# EAGLE schematic ControlBoard (EAGLE 9.2.2)

## Sheet 1 of 4: Connectors & LEDs
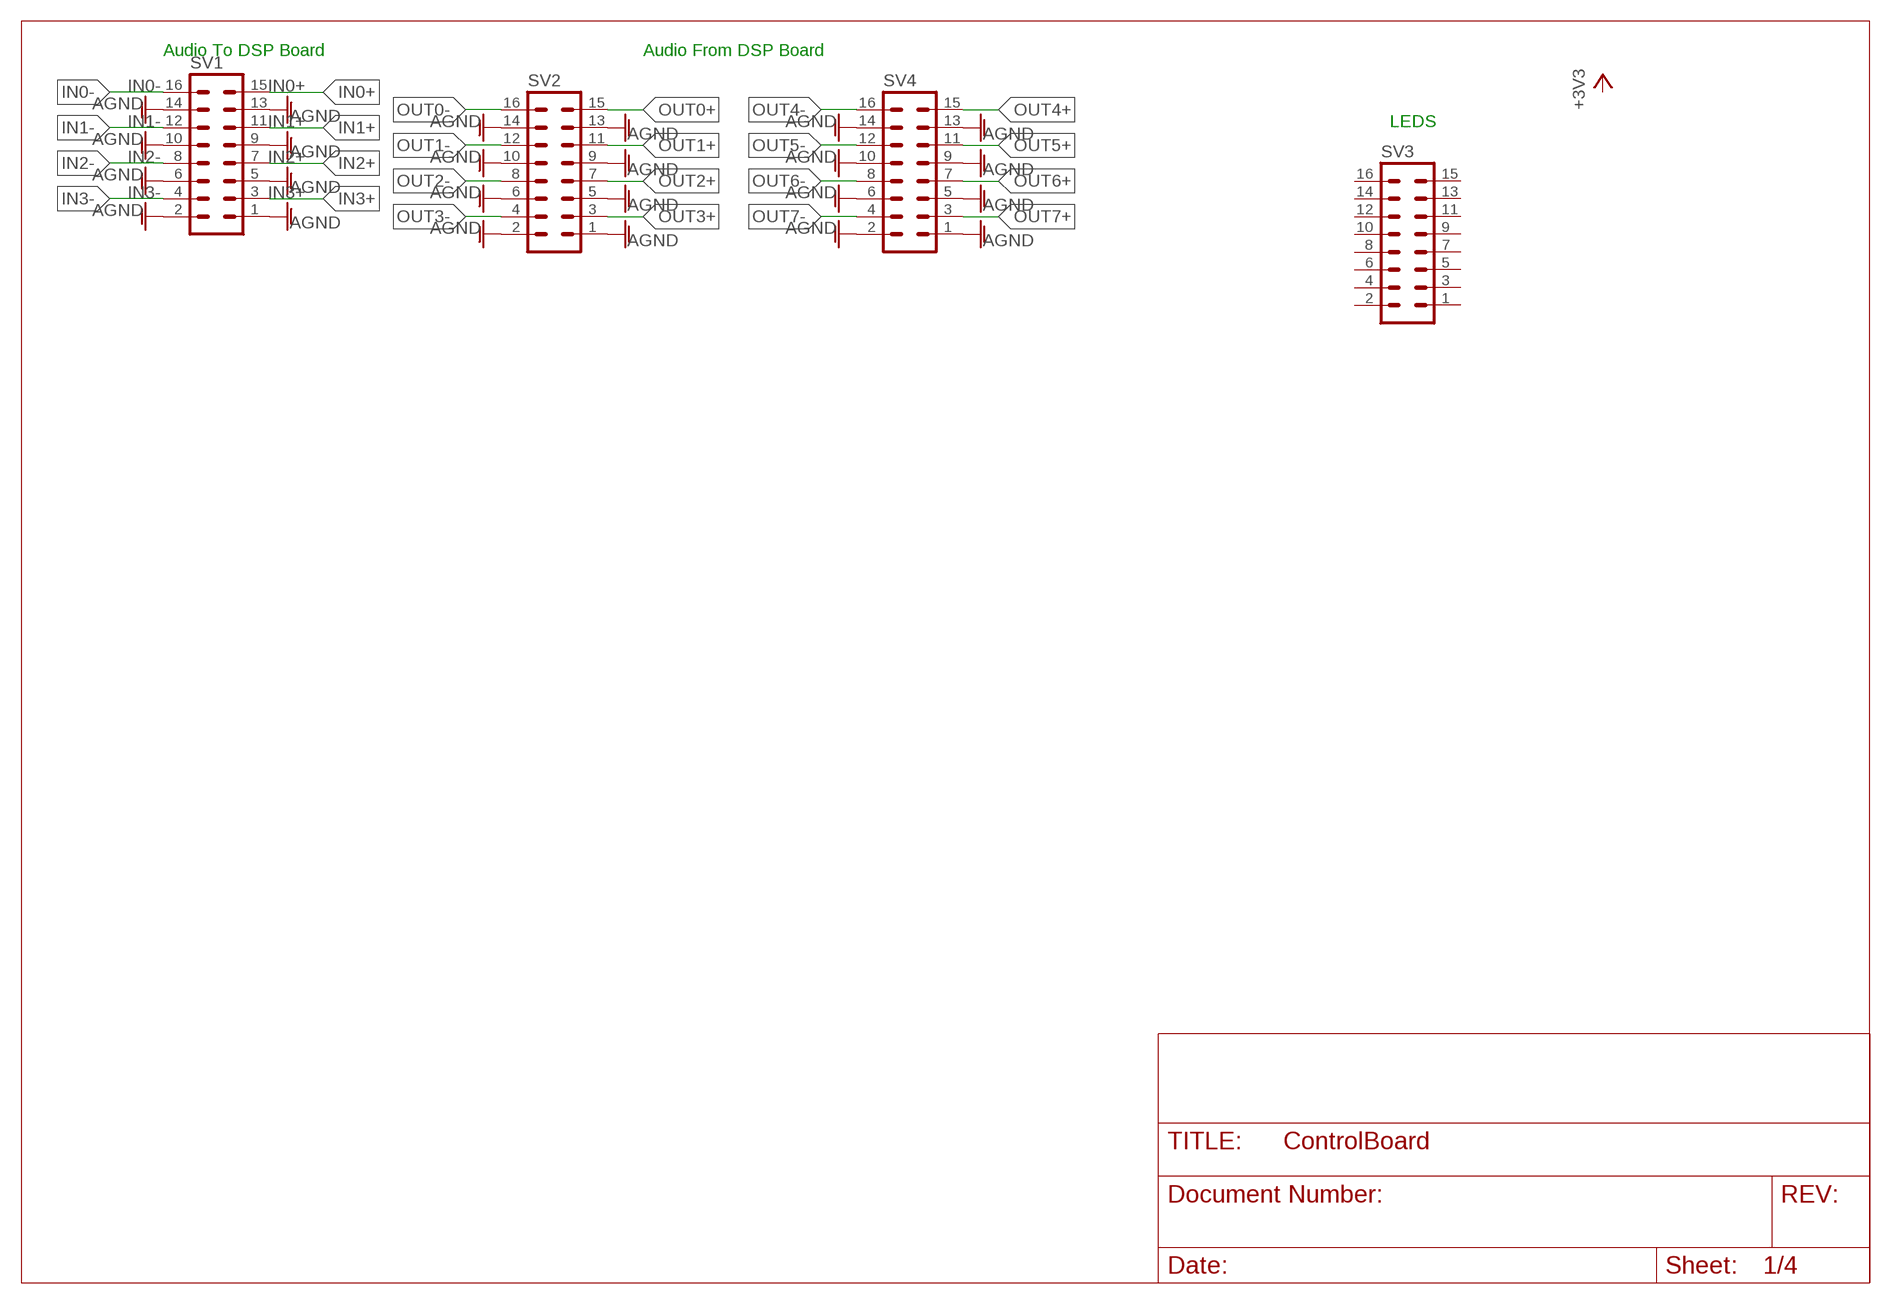
[diagram p0: schematic, sheet 1]

### Parts
SV1  MA08-2  [MA08-2]
SV2  MA08-2  [MA08-2]
SV3  MA08-2  [MA08-2]
SV4  MA08-2  [MA08-2]

### Nets
AGND: SV1.1 SV1.2 SV1.5 SV1.6 SV1.9 SV1.10 SV1.13 SV1.14 SV2.1 SV2.2 SV2.5 SV2.6 SV2.9 SV2.10 SV2.13 SV2.14 SV4.1 SV4.2 SV4.5 SV4.6 SV4.9 SV4.10 SV4.13 SV4.14
IN0+: SV1.15
IN0-: SV1.16
IN1+: SV1.11
IN1-: SV1.12
IN2+: SV1.7
IN2-: SV1.8
IN3+: SV1.3
IN3-: SV1.4
OUT0+: SV2.15
OUT0-: SV2.16
OUT1+: SV2.11
OUT1-: SV2.12
OUT2+: SV2.7
OUT2-: SV2.8
OUT3+: SV2.3
OUT3-: SV2.4
OUT4+: SV4.15
OUT4-: SV4.16
OUT5+: SV4.11
OUT5-: SV4.12
OUT6+: SV4.7
OUT6-: SV4.8
OUT7+: SV4.3
OUT7-: SV4.4
Unconnected: SV3.1 SV3.2 SV3.3 SV3.4 SV3.5 SV3.6 SV3.7 SV3.8 SV3.9 SV3.10 SV3.11 SV3.12 SV3.13 SV3.14 SV3.15 SV3.16

### Notes on the sheet
- Audio To DSP Board | Audio From DSP Board
- LEDS

## Sheet 2 of 4: Analog In
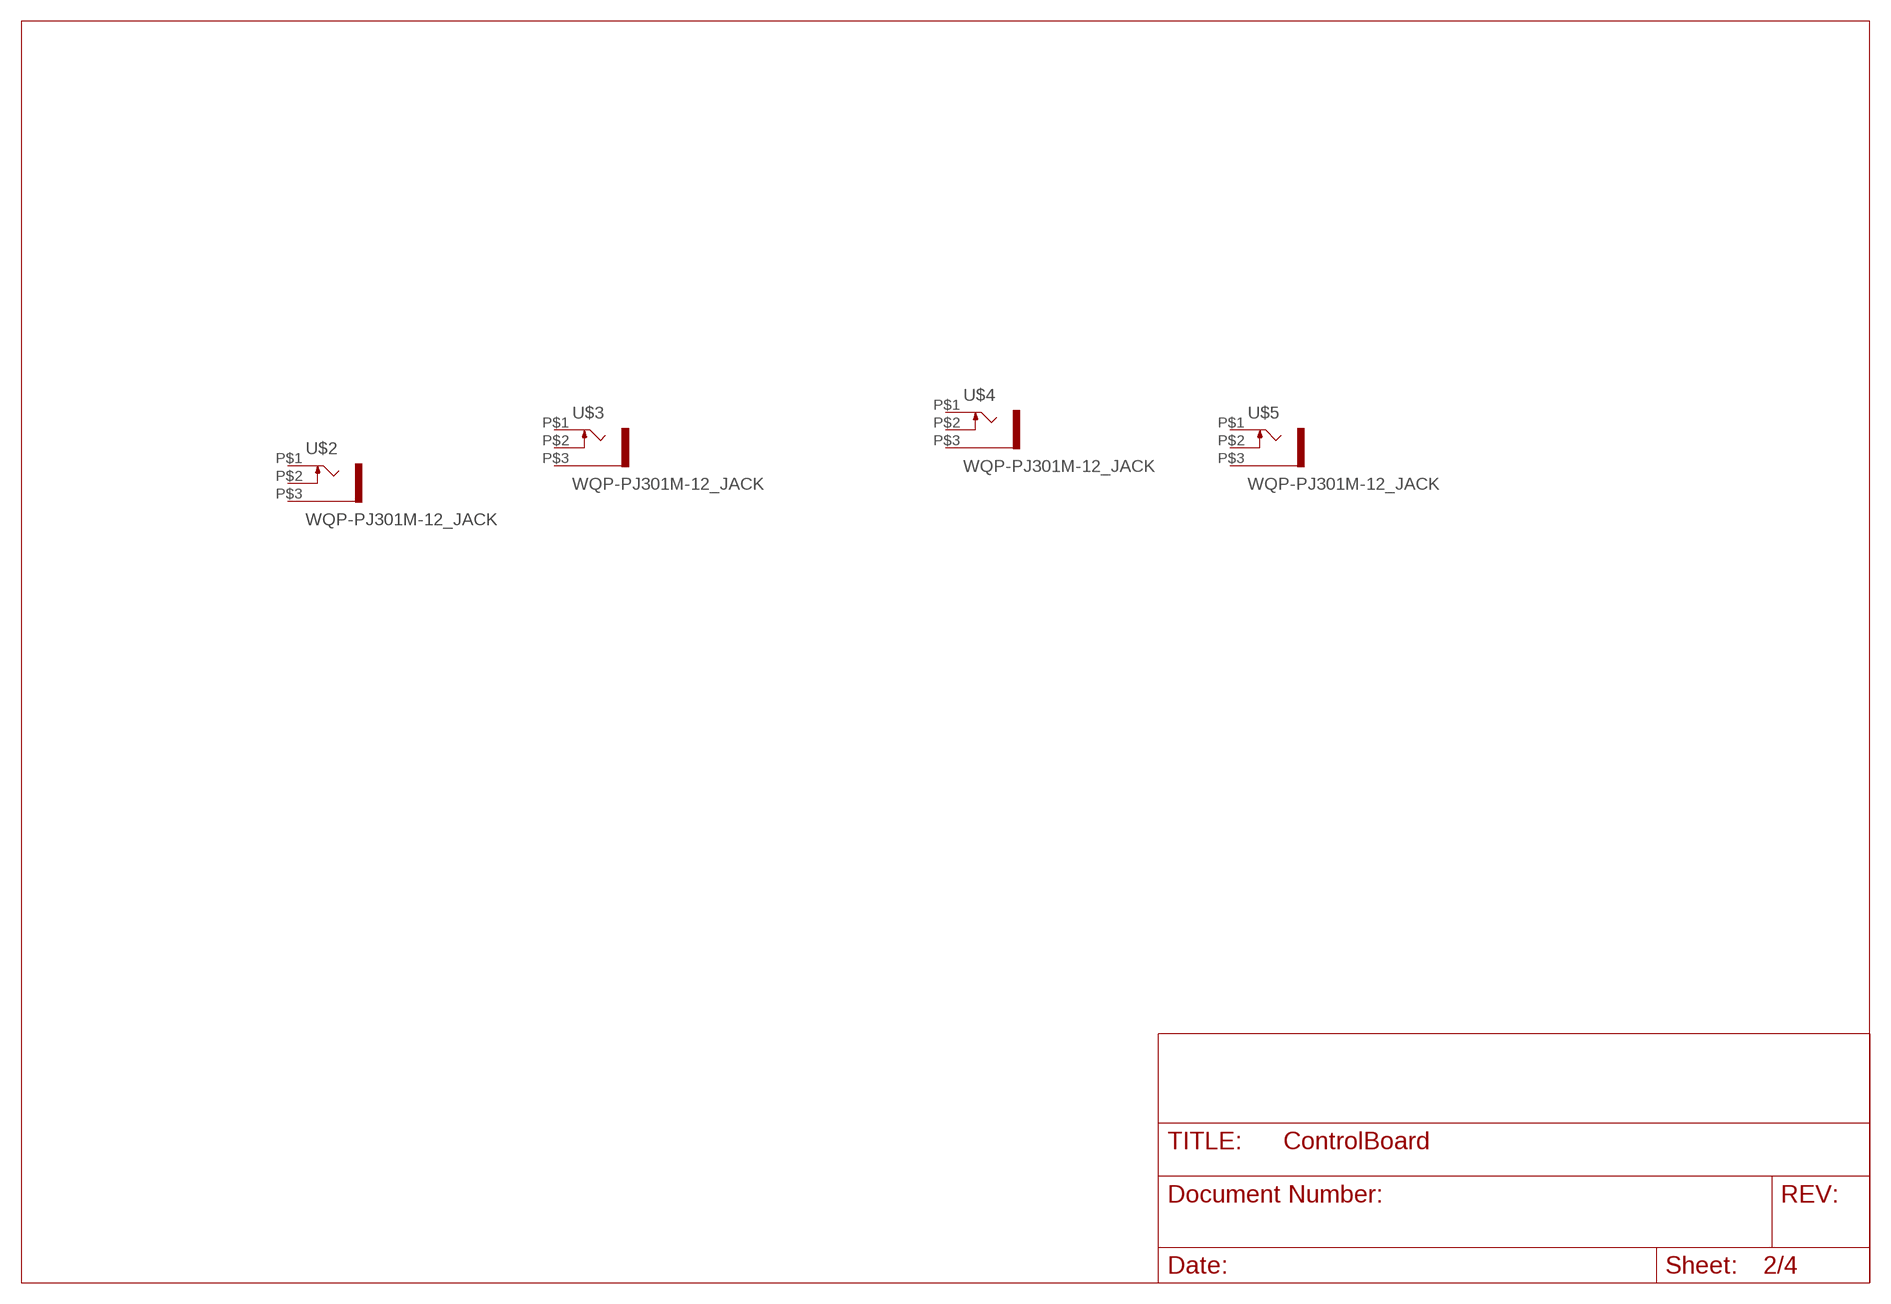
[diagram p1: schematic, sheet 2]

### Parts
U$2  WQP-PJ301M-12_JACK  [WQP-PJ301M-12_JACK]
U$3  WQP-PJ301M-12_JACK  [WQP-PJ301M-12_JACK]
U$4  WQP-PJ301M-12_JACK  [WQP-PJ301M-12_JACK]
U$5  WQP-PJ301M-12_JACK  [WQP-PJ301M-12_JACK]
Unconnected: U$2.P$1 U$2.P$2 U$2.P$3 U$3.P$1 U$3.P$2 U$3.P$3 U$4.P$1 U$4.P$2 U$4.P$3 U$5.P$1 U$5.P$2 U$5.P$3

## Sheet 3 of 4: Analog Out
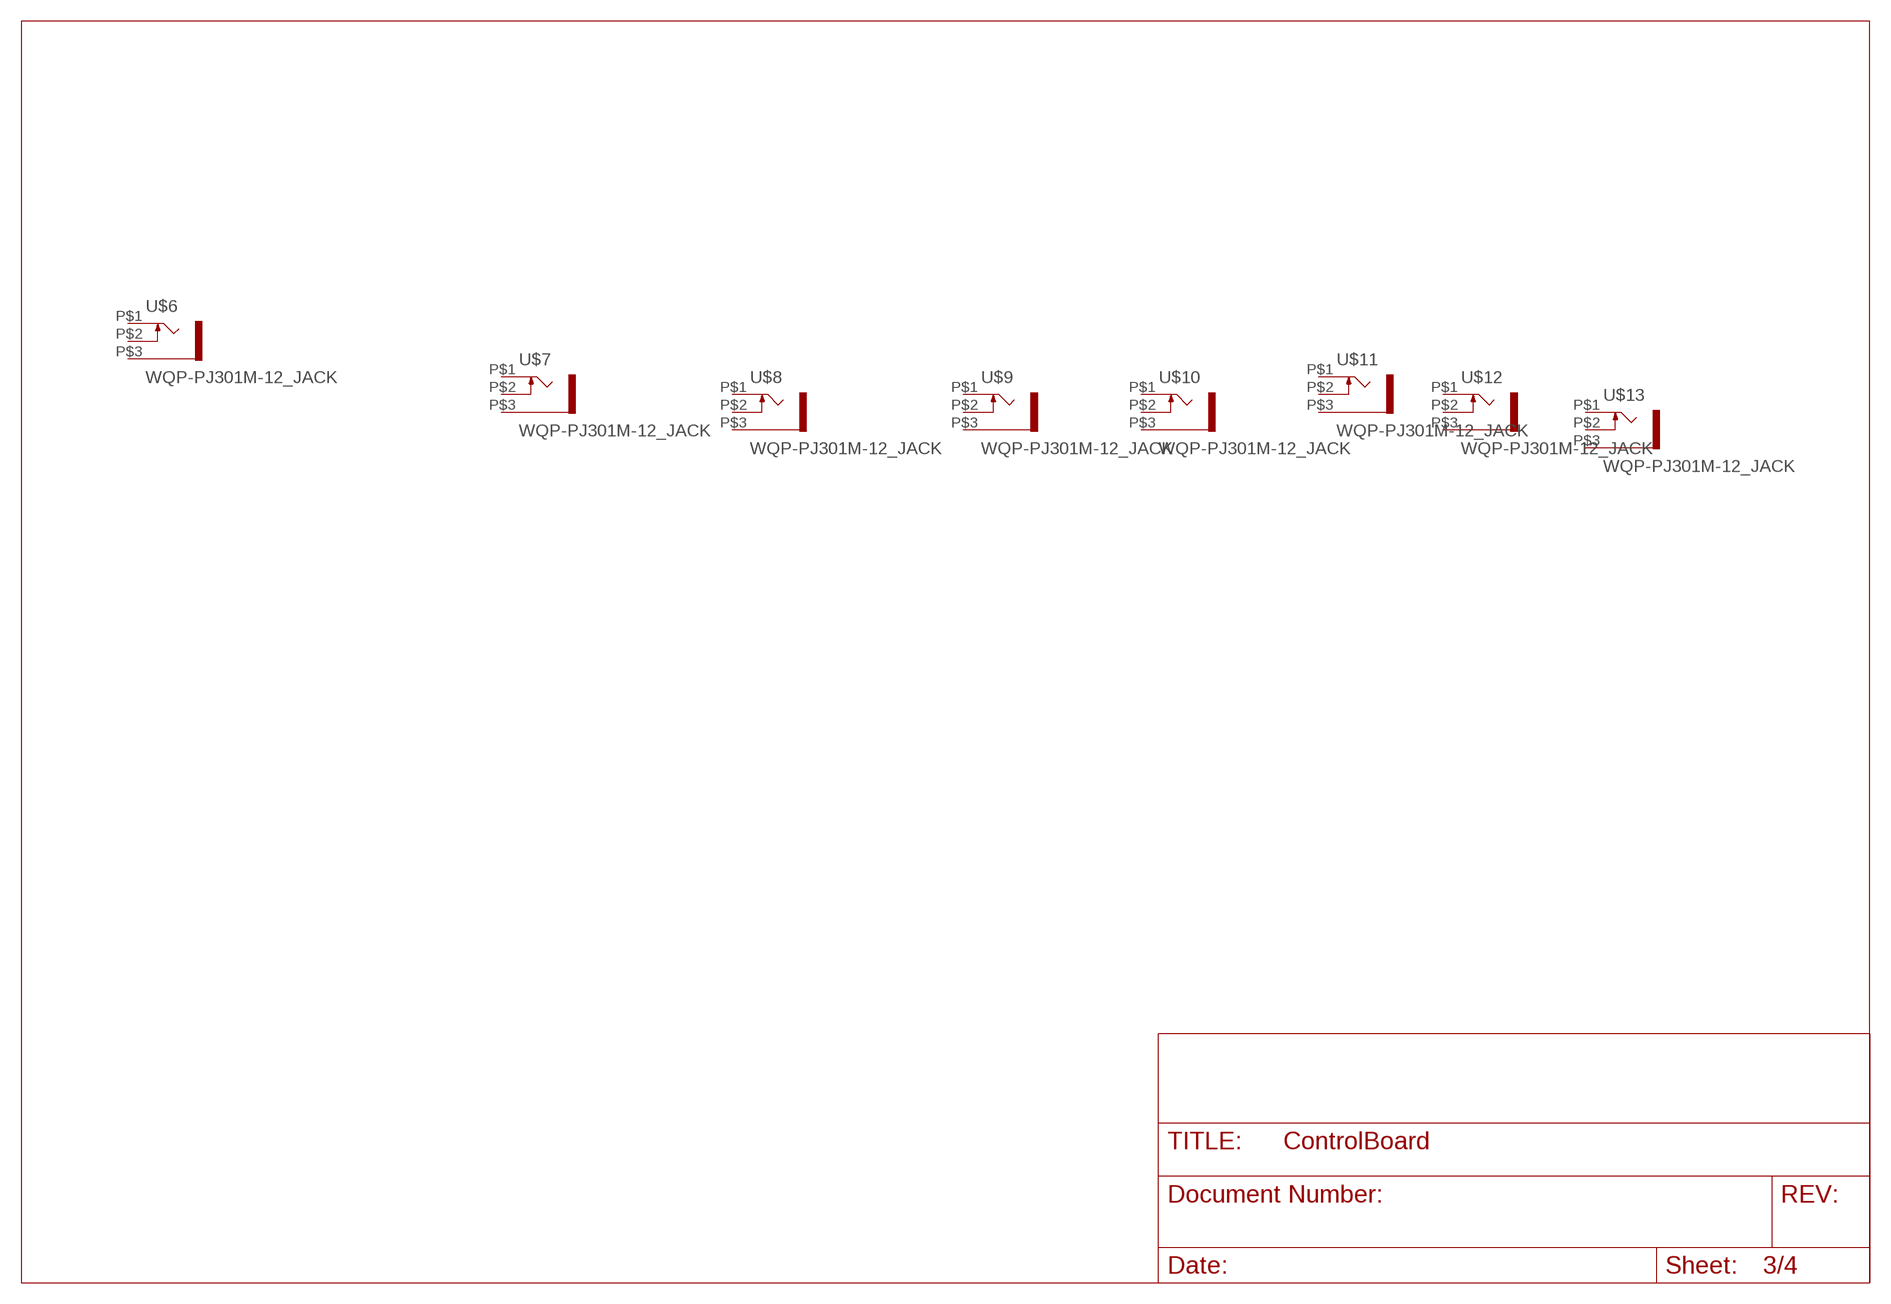
[diagram p2: schematic, sheet 3]

### Parts
U$6  WQP-PJ301M-12_JACK  [WQP-PJ301M-12_JACK]
U$7  WQP-PJ301M-12_JACK  [WQP-PJ301M-12_JACK]
U$8  WQP-PJ301M-12_JACK  [WQP-PJ301M-12_JACK]
U$9  WQP-PJ301M-12_JACK  [WQP-PJ301M-12_JACK]
U$10  WQP-PJ301M-12_JACK  [WQP-PJ301M-12_JACK]
U$11  WQP-PJ301M-12_JACK  [WQP-PJ301M-12_JACK]
U$12  WQP-PJ301M-12_JACK  [WQP-PJ301M-12_JACK]
U$13  WQP-PJ301M-12_JACK  [WQP-PJ301M-12_JACK]
Unconnected: U$6.P$1 U$6.P$2 U$6.P$3 U$7.P$1 U$7.P$2 U$7.P$3 U$8.P$1 U$8.P$2 U$8.P$3 U$9.P$1 U$9.P$2 U$9.P$3 U$10.P$1 U$10.P$2 U$10.P$3 U$11.P$1 U$11.P$2 U$11.P$3 U$12.P$1 U$12.P$2 U$12.P$3 U$13.P$1 U$13.P$2 U$13.P$3

## Sheet 4 of 4: CV and Encoders
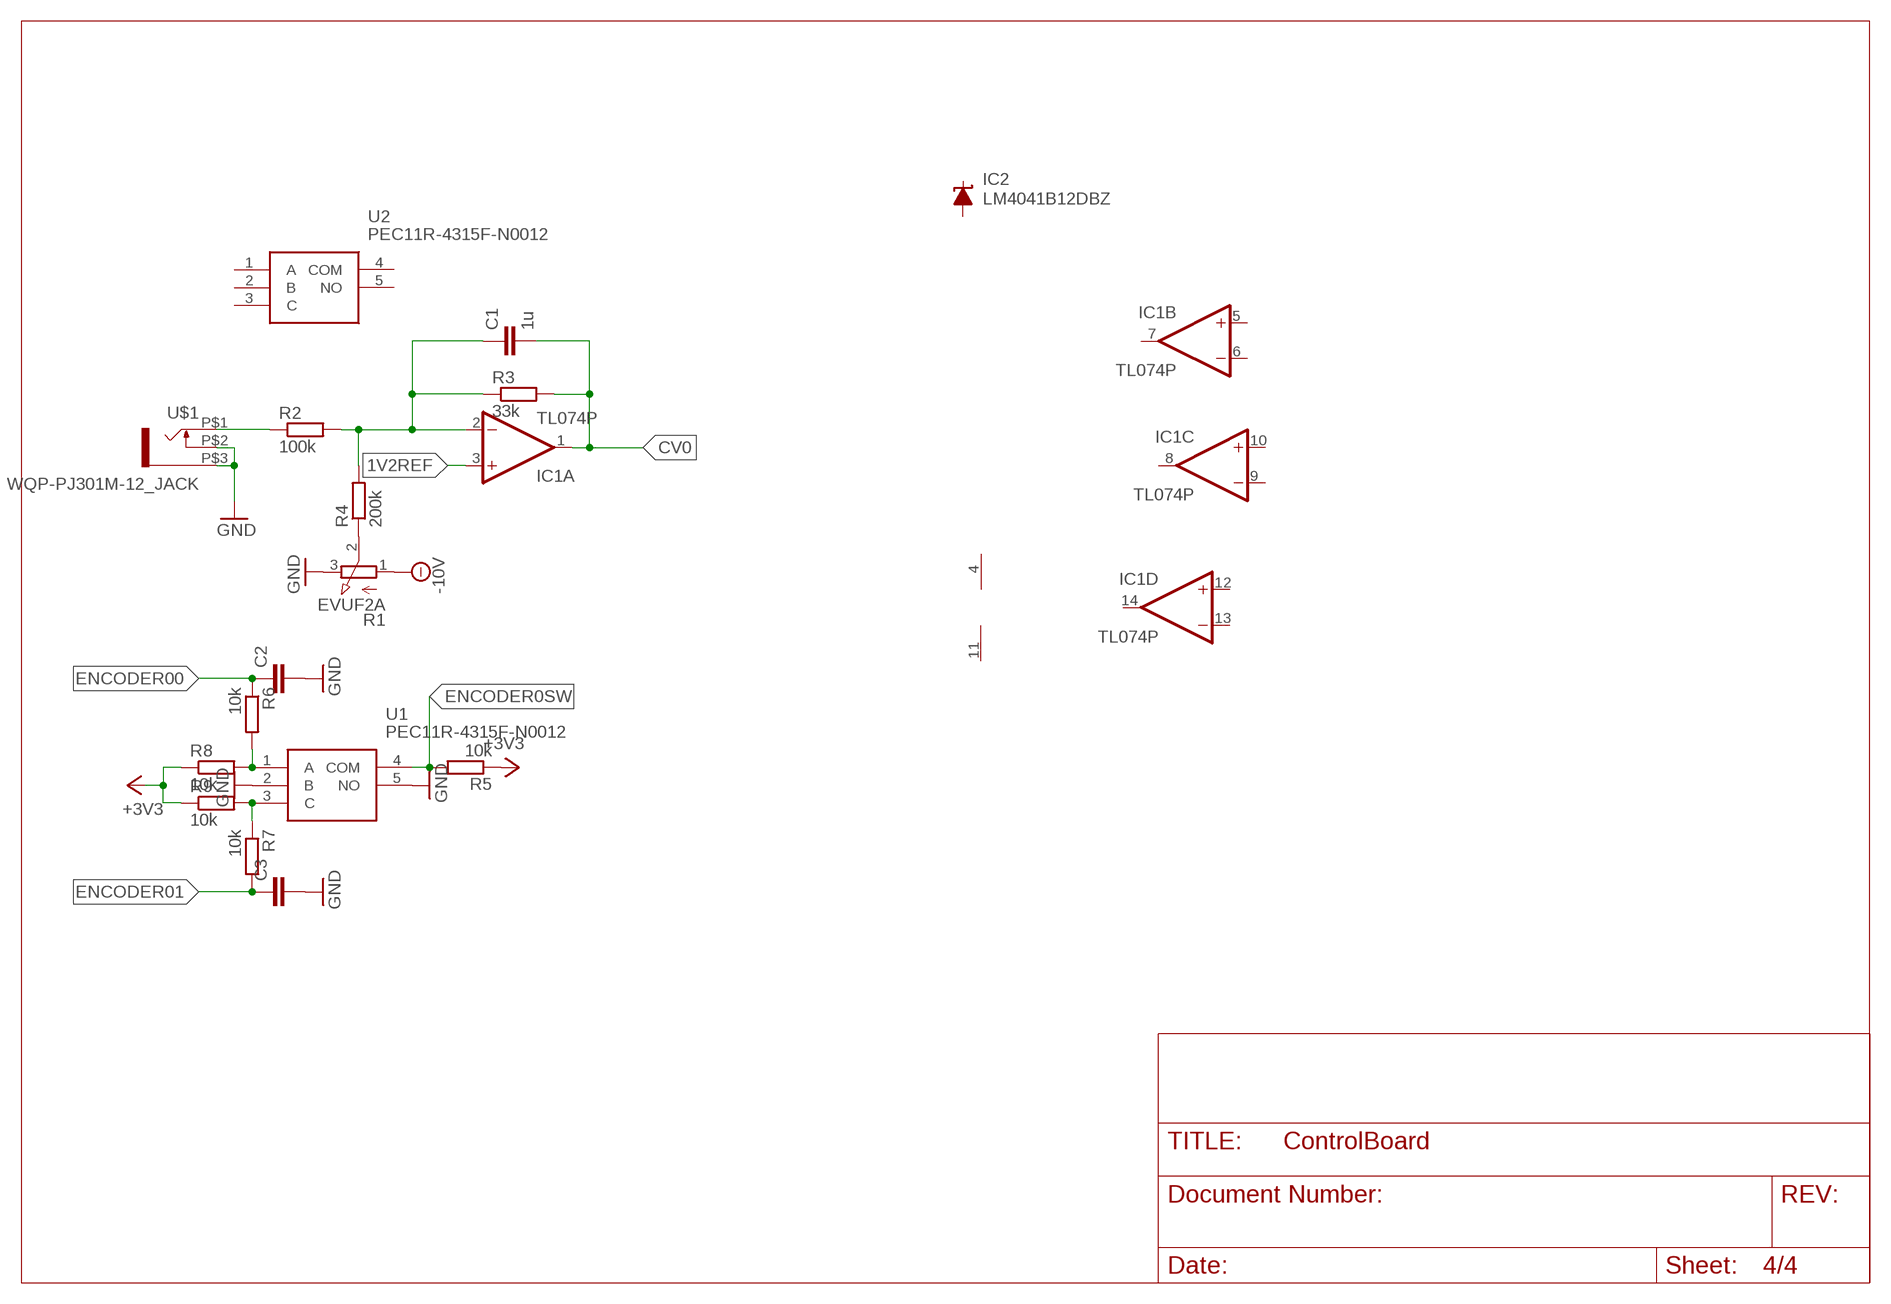
[diagram p3: schematic, sheet 4]

### Parts
C1  1u  C-EUC0805  [C0805]
C2  C-EUC0805  [C0805]
C3  C-EUC0805  [C0805]
IC1  TL074P  [DIL14]
IC2  LM4041B12DBZ  [DBZ_R-PDSO-G3]
R1  EVUF2A  [EVUF]
R2  100k  R-EU_R0805  [R0805]
R3  33k  R-EU_R0805  [R0805]
R4  200k  R-EU_R0805  [R0805]
R5  10k  R-EU_R0805  [R0805]
R6  10k  R-EU_R0805  [R0805]
R7  10k  R-EU_R0805  [R0805]
R8  10k  R-EU_R0805  [R0805]
R9  10k  R-EU_R0805  [R0805]
U1  PEC11R-4315F-N0012  [PEC12R-4XXXF-SXXXX_1]
U2  PEC11R-4315F-N0012  [PEC12R-4XXXF-SXXXX_1]
U$1  WQP-PJ301M-12_JACK  [WQP-PJ301M-12_JACK]

### Nets
1V2REF: IC1.3(A:+IN)
+3V3: R5.1 R8.1 R9.1
-10V: R1.1(A)
CV0: C1.2 IC1.1(A:OUT) R3.2
ENCODER00: C2.1 R6.1
ENCODER0SW: R5.2 U1.4(COM)
ENCODER01: C3.1 R7.2
GND: C2.2 C3.2 R1.3(E) U1.2(B) U1.5(NO) U$1.P$2 U$1.P$3
N$1: R2.1 U$1.P$1
N$2: R1.2(S) R4.1
N$3: C1.1 IC1.2(A:-IN) R2.2 R3.1 R4.2
N$4: R6.2 R8.2 U1.1(A)
N$5: R7.1 R9.2 U1.3(C)
Unconnected: IC1.5(B:+IN) IC1.6(B:-IN) IC1.7(B:OUT) IC1.8(C:OUT) IC1.9(C:-IN) IC1.10(C:+IN) IC1.12(D:+IN) IC1.13(D:-IN) IC1.14(D:OUT) IC2.1(C) IC2.2(A) U2.1(A) U2.2(B) U2.3(C) U2.4(COM) U2.5(NO)

## Power pins joined to a net without a drawn wire
V+: IC1.4(P:V+)
V-: IC1.11(P:V-)

## Library data of the parts
C1-C3 = rcl:C-EU: CAPACITOR, European symbol; SPICEPREFIX: C
IC1 = linear:TL074: OP AMP
IC2 = texas:LM4041: PRECISION MICROPOWER SHUNT VOLTAGE REFERENCE Source: http://focus.ti.com/lit/ds/slcs146e/slcs146e.pdf; MPN: LM4041B12IDBZR; OC_FARNELL: 1575212; OC_NEWARK: 58K5882
R1 = pot:EVU: 9 mm Square Rotary Potentiometers Source: Panasonic
R2-R9 = rcl:R-EU_: RESISTOR, European symbol; SPICEPREFIX: R
SV1-SV4 = con-lstb:MA08-2: PIN HEADER; OC_FARNELL: unknown; OC_NEWARK: unknown
U1 U2 = SamacSys_Parts:PEC11R-4315F-N0012: Encoders ENCODER Source: Datasheet <https://componentsearchengine.com/Datasheets/1/PEC11R-4315F-N0012.pdf>; DESCRIPTION: Encoders ENCODER; HEIGHT: mm; MANUFACTURER_NAME: Bourns; MANUFACTURER_PART_NUMBER: PEC11R-4315F-N0012; MOUSER_PART_NUMBER: 652-PEC11R4315FN0012
U$1-U$13 = thonkiconn:WQP-PJ301M-12_JACK